# EAGLE design shiftpwm_tlc5916_SMD_RGB (EAGLE 6.3)
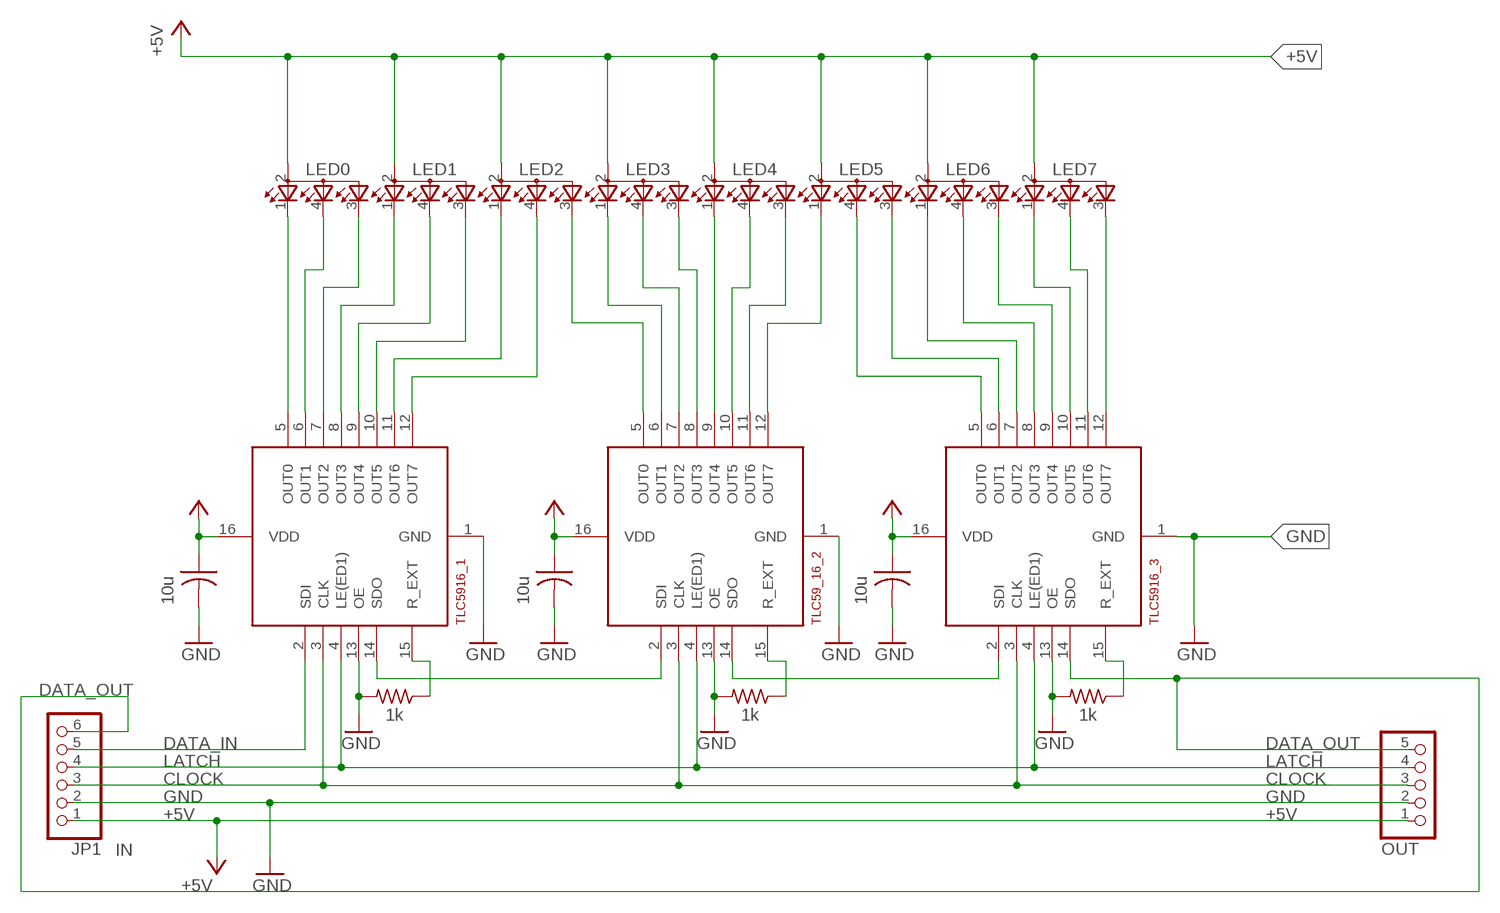
[diagram p0: schematic, sheet 1]

## Parts
C1  10u  C-USC0805K  [C0805K]
C2  10u  C-USC0805K  [C0805K]
C3  10u  C-USC0805K  [C0805K]
JP1  IN  PINHD-1X6  [1X06]
LED0  PLLC4-RGB-ELCOSMALL  [P-LCC-4-3-ELCO]
LED1  PLLC4-RGB-ELCOSMALL  [P-LCC-4-3-ELCO]
LED2  PLLC4-RGB-ELCOSMALL  [P-LCC-4-3-ELCO]
LED3  PLLC4-RGB-ELCOSMALL  [P-LCC-4-3-ELCO]
LED4  PLLC4-RGB-ELCOSMALL  [P-LCC-4-3-ELCO]
LED5  PLLC4-RGB-ELCOSMALL  [P-LCC-4-3-ELCO]
LED6  PLLC4-RGB-ELCOSMALL  [P-LCC-4-3-ELCO]
LED7  PLLC4-RGB-ELCOSMALL  [P-LCC-4-3-ELCO]
OUT  PINHD-1X5  [1X05]
R1  1k  R-US_R0805  [R0805]
R2  1k  R-US_R0805  [R0805]
R3  1k  R-US_R0805  [R0805]
TLC59_16_2  TLC5916/17  [SOIC-16]
TLC5916_1  TLC5916/17  [SOIC-16]
TLC5916_3  TLC5916/17  [SOIC-16]

## Nets
+5V: C1.1 C2.1 C3.1 JP1.1 LED0.2(A2) LED1.2(A2) LED2.2(A2) LED3.2(A2) LED4.2(A2) LED5.2(A2) LED6.2(A2) LED7.2(A2) OUT.1 TLC59_16_2.16(VDD) TLC5916_1.16(VDD) TLC5916_3.16(VDD)
CLOCK: JP1.3 OUT.3 TLC59_16_2.3(CLK) TLC5916_1.3(CLK) TLC5916_3.3(CLK)
DATA_IN: JP1.5 TLC5916_1.2(SDI)
DATA_OUT: JP1.6 OUT.5 TLC5916_3.14(SDO)
GND: C1.2 C2.2 C3.2 JP1.2 OUT.2 R1.2 R2.2 R3.2 TLC59_16_2.1(GND) TLC59_16_2.13(OE) TLC5916_1.1(GND) TLC5916_1.13(OE) TLC5916_3.1(GND) TLC5916_3.13(OE)
LATCH: JP1.4 OUT.4 TLC59_16_2.4(LE(ED1)) TLC5916_1.4(LE(ED1)) TLC5916_3.4(LE(ED1))
N$2: TLC59_16_2.14(SDO) TLC5916_3.2(SDI)
N$3: R2.1 TLC59_16_2.15(R_EXT)
N$4: R1.1 TLC5916_1.15(R_EXT)
N$5: TLC59_16_2.2(SDI) TLC5916_1.14(SDO)
N$6: LED7.3(CBLUE) TLC5916_3.12(OUT7)
N$8: R3.1 TLC5916_3.15(R_EXT)
N$26: LED0.1(CRED) TLC5916_1.5(OUT0)
N$27: LED0.4(CGREEN) TLC5916_1.6(OUT1)
N$28: LED0.3(CBLUE) TLC5916_1.7(OUT2)
N$29: LED1.1(CRED) TLC5916_1.8(OUT3)
N$30: LED1.4(CGREEN) TLC5916_1.9(OUT4)
N$31: LED1.3(CBLUE) TLC5916_1.10(OUT5)
N$32: LED2.1(CRED) TLC5916_1.11(OUT6)
N$33: LED2.4(CGREEN) TLC5916_1.12(OUT7)
N$34: LED2.3(CBLUE) TLC59_16_2.5(OUT0)
N$36: LED3.1(CRED) TLC59_16_2.6(OUT1)
N$37: LED3.4(CGREEN) TLC59_16_2.7(OUT2)
N$38: LED3.3(CBLUE) TLC59_16_2.8(OUT3)
N$39: LED4.1(CRED) TLC59_16_2.9(OUT4)
N$40: LED4.4(CGREEN) TLC59_16_2.10(OUT5)
N$41: LED4.3(CBLUE) TLC59_16_2.11(OUT6)
N$42: LED5.1(CRED) TLC59_16_2.12(OUT7)
N$44: LED7.4(CGREEN) TLC5916_3.11(OUT6)
N$45: LED7.1(CRED) TLC5916_3.10(OUT5)
N$46: LED6.3(CBLUE) TLC5916_3.9(OUT4)
N$47: LED6.4(CGREEN) TLC5916_3.8(OUT3)
N$48: LED6.1(CRED) TLC5916_3.7(OUT2)
N$49: LED5.3(CBLUE) TLC5916_3.6(OUT1)
N$50: LED5.4(CGREEN) TLC5916_3.5(OUT0)

## Library data of the parts
C1-C3 = adafruit:C-US: CAPACITOR, American symbol
JP1 = pinhead:PINHD-1X6: PIN HEADER
LED0 LED1-LED7 = led:PLLC4-RGB-ELCO
OUT = pinhead:PINHD-1X5: PIN HEADER
R1-R3 = adafruit:R-US_: RESISTOR, American symbol
TLC59_16_2 TLC5916_1 TLC5916_3 = BillPorter:TLC5916/17: TLC5916/17 8-Channel Constant-Current LED Sink Driver and Shift Register in one. Great for driving high current LEDs that would kill a 595 shift register. Specs @ http://focus.ti.com/docs/prod/folders/print/tlc5916.html

## Board
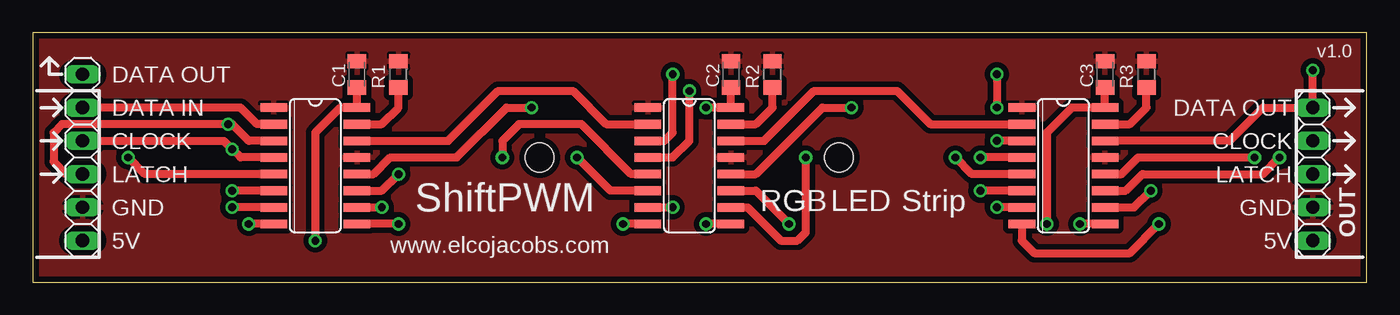
[diagram p1: board, top side]
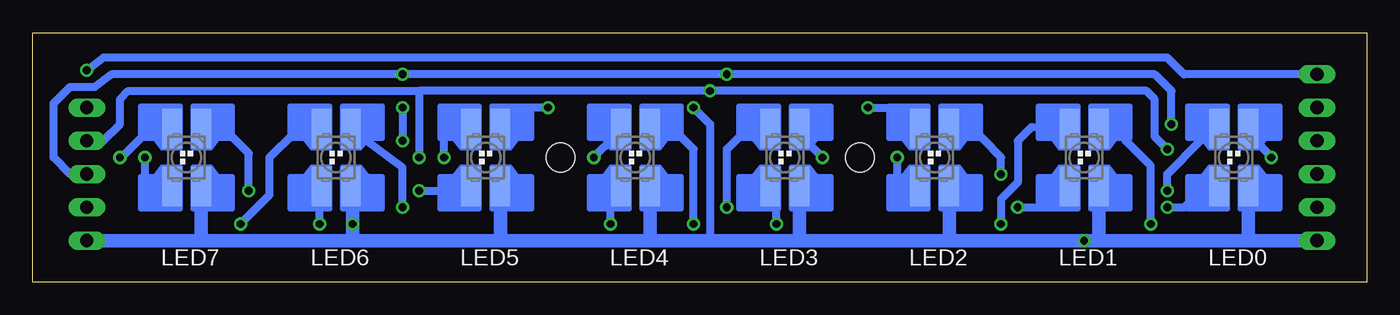
[diagram p2: board, bottom side, seen from below]

Size 101.92 x 19.05 mm. Coordinates in mm from the lower left corner, seen from the top.
Outline: 0,0 101.92,0 101.92,19.05 0,19.04 0,0
Copper layers (1*16): Top 0.018mm / dielectric 1.55mm / Bottom 0.018mm
Design rules "eC-STANDARD_pool-2-layer  *": minimum track width 0.15mm, minimum drill 0.25mm, track to track 0.15mm, track to pad 0.15mm, pad to pad 0.15mm, via to via 0.15mm, smd to smd 0.15mm, copper to edge 0.45mm, drill to drill 0.3mm, minimum pad ring 0.2mm, minimum via ring 0.2mm, stop-mask expansion 0.1mm, vias tented up to drill 200mil, thermal gap 0.2mm
Holes 2.2 mm at 38.73,9.53 61.59,9.53

### Footprints (pad centres in the part's own frame; a part is rotated, then mirrored left to right if it is on the bottom)
C0805K = smd 1.1 x 1.4: 1 -1,0; 2 1,0
1X06 = drill 1.016 long: 1 -6.35,0; 2 -3.81,0; 3 -1.27,0; 4 1.27,0; 5 3.81,0; 6 6.35,0
P-LCC-4-3-ELCO = smd 1.5 x 3: 1 -1.125,-2.21; 2 -1.125,2.21; 3 1.125,2.21; 4 1.125,-2.21
1X05 = drill 1.016 long: 1 -5.08,0; 2 -2.54,0; 3 0,0; 4 2.54,0; 5 5.08,0
R0805 = smd 1.1 x 1.4: 1 -1,0; 2 1,0
SOIC-16 = smd 0.66 x 2.032: 1 -3.81,-3.175; 2 -2.54,-3.175; 3 -1.27,-3.175; 4 0,-3.175; 5 1.27,-3.175; 6 2.54,-3.175; 7 3.81,-3.175; 8 5.08,-3.175; 9 5.08,3.175; 10 3.81,3.175; 11 2.54,3.175; 12 1.27,3.175; 13 0,3.175; 14 -1.27,3.175; 15 -2.54,3.175; 16 -3.81,3.175

### Placement (x,y rotation side)
C1  24.76,15.88 90 top
C2  53.34,15.88 90 top
C3  81.92,15.88 90 top
JP1  3.81,9.53 90 top
LED0  10.16,9.53 180 bottom
LED1  21.59,9.53 180 bottom
LED2  33.02,9.53 180 bottom
LED3  44.45,9.53 180 bottom
LED4  55.88,9.53 180 bottom
LED5  67.31,9.53 180 bottom
LED6  78.74,9.53 180 bottom
LED7  90.17,9.53 180 bottom
OUT  97.79,8.25 90 top
R1  27.94,15.88 90 top
R2  56.52,15.88 90 top
R3  85.09,15.88 90 top
TLC59_16_2  50.16,9.53 270 top
TLC5916_1  21.59,9.53 270 top
TLC5916_3  78.74,9.53 270 top

### Tracks (layer width: path | path; a pad name or v marks a point on that pad's centre or on a via)
+5V  (via drill 0.6)
  Top 0.61: v21.59,3.17 21.59,11.43 23.49,13.33 TLC5916_1.16 C1.1 | v51.44,13.33 TLC59_16_2.16 C2.1 | C3.1 TLC5916_3.16 79.38,13.33 77.47,11.43 v77.47,4.45
  Bottom 0.61: v51.44,13.33 50.16,12.06 50.16,3.17
  Bottom 1.016: 8.89,3.17 20.32,3.17 | 20.32,3.17 v21.59,3.17 31.75,3.17 | 31.75,3.17 43.18,3.17 | 43.18,3.17 50.16,3.17 54.61,3.17 | 54.61,3.17 66.04,3.17 | 66.04,3.17 77.47,3.17 | 77.47,3.17 v77.47,4.45 77.47,7.17 LED6.2 | 77.47,3.17 88.9,3.17 | JP1.1 8.89,3.17 | 88.9,3.17 OUT.1 | LED7.2 89.05,3.32 88.9,3.17 | LED5.2 66.19,3.32 66.04,3.17 | LED4.2 54.76,3.32 54.61,3.17 | LED3.2 43.33,3.32 43.18,3.17 | LED2.2 31.89,3.32 31.75,3.17 | LED1.2 20.46,3.32 20.32,3.17 | LED0.2 9.04,3.32 8.89,3.17
CLOCK  (via drill 0.6)
  Top 0.61: TLC5916_1.3 16.51,10.79 15.24,12.06 v14.92,12.06 2.22,12.06 1.59,11.43 1.59,9.21 2.54,8.25 JP1.3 | TLC59_16_2.3 48.26,10.79 48.9,11.43 v48.9,15.88 | TLC5916_3.3 v73.66,10.79 | v73.66,15.88 v73.66,13.33
  Bottom 0.61: v14.92,12.06 14.92,14.6 16.19,15.88 v48.9,15.88 v73.66,15.88 95.89,15.88 97.16,14.92 99.06,14.92 100.33,13.65 100.33,9.53 99.06,8.25 OUT.3 | v73.66,13.33 v73.66,10.79
DATA_IN
  Top 0.61: TLC5916_1.2 17.14,12.06 15.88,13.33 JP1.5
DATA_OUT  (via drill 0.6)
  Top 0.61: TLC5916_3.14 91.44,10.79 93.98,13.33 OUT.5 v97.79,16.19
  Bottom 0.61: JP1.6 13.97,15.88 15.24,17.14 96.52,17.14 v97.79,16.19
GND
  pour Top (isolate 0.406): 0.32,19.05 0,0 101.92,0 101.92,19.05
LATCH  (via drill 0.6)
  Top 0.61: TLC5916_1.4 15.88,9.53 v15.24,10.16 14.61,10.79 JP1.4 | TLC59_16_2.4 48.9,9.53 50.16,10.79 v50.16,14.6 | TLC5916_3.4 v72.39,9.53
  Bottom 0.61: v15.24,10.16 16.19,11.11 16.19,13.97 16.83,14.6 v50.16,14.6 72.39,14.6 | 72.39,14.6 94.62,14.6 95.25,13.97 95.25,12.06 96.52,10.79 OUT.4 | 72.39,14.6 v72.39,9.53
N$2
  Top 0.61: TLC59_16_2.14 55.88,10.79 59.69,14.6 66.04,14.6 68.58,12.06 TLC5916_3.2
N$3
  Top 0.61: TLC59_16_2.15 55.25,12.06 56.52,13.33 R2.1
N$4
  Top 0.61: TLC5916_1.15 26.67,12.06 27.94,13.33 R1.1
N$5
  Top 0.61: TLC5916_1.14 31.75,10.79 35.56,14.6 41.28,14.6 43.82,12.06 TLC59_16_2.2
N$6  (via drill 0.6)
  Top 0.61: TLC5916_3.12 83.19,8.25 84.45,9.53 v93.34,9.53
  Bottom 0.61: v93.34,9.53 93.34,7.42 LED7.3
N$8
  Top 0.61: TLC5916_3.15 83.82,12.06 85.09,13.33 R3.1
N$26  (via drill 0.6)
  Top 0.61: TLC5916_1.5 8.57,8.25 v7.3,9.53
  Bottom 0.61: LED0.1 8.57,10.87 7.3,9.6 v7.3,9.53
N$27  (via drill 0.6)
  Top 0.61: TLC5916_1.6 v15.24,6.99
  Bottom 0.61: v15.24,6.99 15.24,8.25 12.7,10.79 12.7,11.43 11.43,12.06 12.7,12.13 LED0.4
N$28  (via drill 0.6)
  Top 0.61: TLC5916_1.7 v15.24,5.71
  Bottom 0.61: v15.24,5.71 13.97,5.71 12.7,6.92 | 12.7,6.99 12.7,6.92 | 12.7,6.92 LED0.3
N$29  (via drill 0.6)
  Top 0.61: TLC5916_1.8 v16.51,4.45
  Bottom 0.61: v16.51,4.45 16.51,8.89 18.41,10.79 19.05,12.13 LED1.1
N$30  (via drill 0.6)
  Top 0.61: v27.94,4.45 TLC5916_1.9
  Bottom 0.61: v27.94,4.45 27.94,6.35 26.67,7.62 26.67,10.79 25.61,11.85 LED1.4
N$31  (via drill 0.6)
  Top 0.61: TLC5916_1.10 v26.67,5.71
  Bottom 0.61: v26.67,5.71 24.13,5.71 24.13,6.92 | 24.13,6.99 24.13,6.92 | 24.13,6.92 LED1.3
N$32  (via drill 0.6)
  Top 0.61: TLC5916_1.11 26.67,6.99 v27.94,8.25
  Bottom 0.61: v27.94,8.25 27.94,9.53 30.48,12.13 LED2.1
N$33  (via drill 0.6)
  Top 0.61: TLC5916_1.12 26.04,8.25 27.3,9.53 32.38,9.53 36.2,13.33 v38.1,13.33
  Bottom 0.61: 36.2,12.06 35.56,12.06 | 35.56,12.06 34.48,12.06 LED2.4 | v38.1,13.33 35.56,13.33 35.56,12.06
N$34  (via drill 0.6)
  Top 0.61: TLC59_16_2.5 45.72,8.25 41.91,12.06 37.15,12.06 35.88,10.79 v35.88,9.53
  Bottom 0.61: v35.88,9.53 35.88,7.62 LED2.3
N$36  (via drill 0.6)
  Top 0.61: TLC59_16_2.6 44.13,6.99 v41.59,9.53
  Bottom 0.61: v41.59,9.53 42.55,10.48 LED3.1
N$37  (via drill 0.6)
  Top 0.61: TLC59_16_2.7 v48.9,5.71
  Bottom 0.61: v48.9,5.71 48.9,10.16 47.62,11.43 46.87,11.43 LED3.4
N$38  (via drill 0.6)
  Top 0.61: TLC59_16_2.8 v45.09,4.45
  Bottom 0.61: LED3.3 46.36,7.11 46.36,6.35 45.72,6.35 45.09,5.71 v45.09,4.45
N$39  (via drill 0.6)
  Top 0.61: TLC59_16_2.9 v51.44,4.45
  Bottom 0.61: v51.44,4.45 51.44,10.16 53.34,12.06 53.66,12.06 LED4.1
N$40  (via drill 0.6)
  Top 0.61: TLC59_16_2.10 54.61,5.71 57.15,3.17 58.42,3.17 59.05,3.81 v59.05,9.53
  Bottom 0.61: LED4.4 57.15,11.31 57.47,11.11 v59.05,9.53
N$41  (via drill 0.6)
  Top 0.61: TLC59_16_2.11 55.25,6.99 v57.79,4.45
  Bottom 0.61: v57.79,4.45 57.79,7.11 LED4.3
N$42  (via drill 0.6)
  Top 0.61: TLC59_16_2.12 55.25,8.25 60.33,13.33 v62.55,13.33
  Bottom 0.61: v62.55,13.33 63.83,13.33 LED5.1
N$44  (via drill 0.6)
  Top 0.61: TLC5916_3.11 83.5,6.99 84.77,8.25 93.98,8.25 v95.25,9.53
  Bottom 0.61: LED7.4 92.91,11.75 94.93,9.72 v95.25,9.53
N$45  (via drill 0.6)
  Top 0.61: TLC5916_3.10 84.14,5.71 v85.41,6.99
  Bottom 0.61: LED7.1 87.3,11.73 85.41,9.84 v85.41,6.99
N$46  (via drill 0.6)
  Top 0.61: TLC5916_3.9 v80.01,4.45
  Bottom 0.61: v80.01,4.45 80.01,5.71 81.28,6.99 80.95,6.99 LED6.3
N$47  (via drill 0.6)
  Top 0.61: TLC5916_3.8 75.56,3.17 76.52,2.22 83.82,2.22 v86.04,4.45
  Bottom 0.61: v86.04,4.45 83.82,6.67 83.82,9.53 81.92,11.43 81.16,11.43 LED6.4
N$48  (via drill 0.6)
  Top 0.61: TLC5916_3.7 v73.66,5.71
  Bottom 0.61: v73.66,5.71 73.66,8.77 LED6.1
N$49  (via drill 0.6)
  Top 0.61: TLC5916_3.6 v72.39,6.99
  Bottom 0.61: v72.39,6.99 69.53,6.99 LED5.3
N$50  (via drill 0.6)
  Top 0.61: TLC5916_3.5 71.75,8.25 v70.48,9.53
  Bottom 0.61: v70.48,9.53 70.48,11.63 LED5.4

### Text on the board
tNames: v1.0 | DATA OUT | DATA OUT | DATA IN | CLOCK | CLOCK | LATCH | LATCH | GND | GND | ShiftPWM | RGB | LED | Strip | 5V | 5V | www.elcojacobs.com